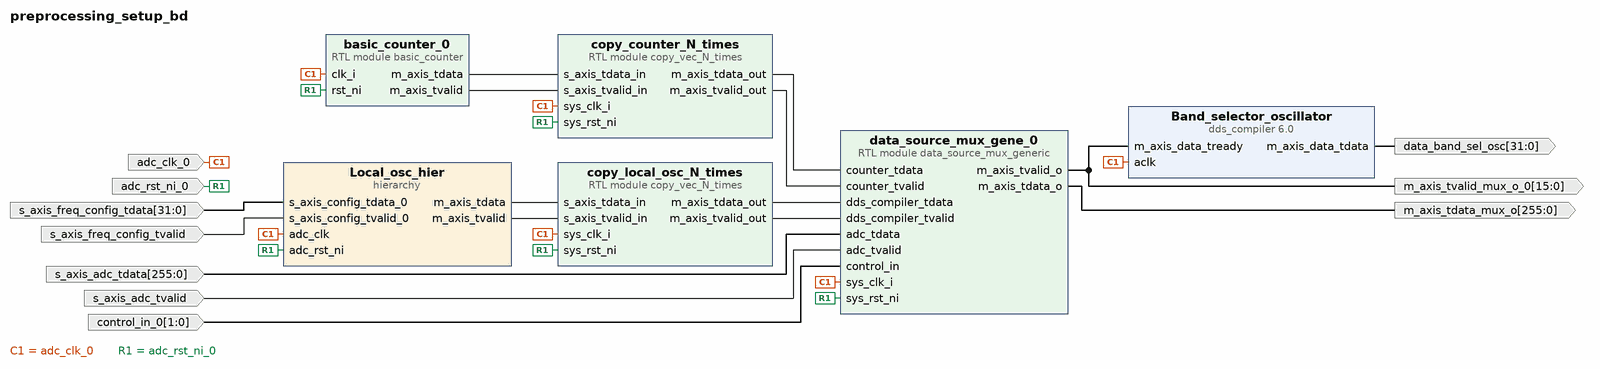
[diagram p0: block diagram of the top level]
# Vivado block design preprocessing_setup_bd, xc7z030fbg676-2, Vivado 2024.2
create_bd_design preprocessing_setup_bd

create_bd_port -dir I -type clk adc_clk_0
create_bd_port -dir I adc_rst_ni_0
create_bd_port -dir I -from 1 -to 0 control_in_0
create_bd_port -dir O -from 31 -to 0 data_band_sel_osc
create_bd_port -dir O -from 255 -to 0 m_axis_tdata_mux_o
create_bd_port -dir O -from 15 -to 0 m_axis_tvalid_mux_o_0
create_bd_port -dir I -from 255 -to 0 s_axis_adc_tdata
create_bd_port -dir I s_axis_adc_tvalid
create_bd_port -dir I -from 31 -to 0 s_axis_freq_config_tdata
create_bd_port -dir I s_axis_freq_config_tvalid

create_bd_cell -type ip -vlnv xilinx.com:ip:dds_compiler:6.0 Band_selector_oscillator
set_property -dict [list \
  CONFIG.Amplitude_Mode Full_Range \
  CONFIG.DATA_Has_TLAST Not_Required \
  CONFIG.DDS_Clock_Rate 260 \
  CONFIG.Frequency_Resolution 0.4 \
  CONFIG.Has_ARESETn false \
  CONFIG.Has_Phase_Out false \
  CONFIG.Has_TREADY true \
  CONFIG.Latency 9 \
  CONFIG.M_DATA_Has_TUSER Not_Required \
  CONFIG.Noise_Shaping None \
  CONFIG.Output_Frequency1 0 \
  CONFIG.Output_Width 16 \
  CONFIG.PINC1 1001000110111001000110111001001 \
  CONFIG.Parameter_Entry Hardware_Parameters \
  CONFIG.Phase_Increment Fixed \
  CONFIG.Phase_Width 32 \
  CONFIG.S_PHASE_Has_TUSER Not_Required \
] [get_bd_cells Band_selector_oscillator]
create_bd_cell -type hier Local_osc_hier
create_bd_cell -type module -reference basic_counter basic_counter_0
set_property -dict {CONFIG.DIVIDE_CLK_FREQ_BY 4} [get_bd_cells basic_counter_0]
create_bd_cell -type module -reference copy_vec_N_times copy_counter_N_times
set_property -dict {CONFIG.DATA_WIDTH 16 CONFIG.N 16} [get_bd_cells copy_counter_N_times]
create_bd_cell -type module -reference copy_vec_N_times copy_local_osc_N_times
set_property -dict {CONFIG.DATA_WIDTH 16 CONFIG.N 16} [get_bd_cells copy_local_osc_N_times]
create_bd_cell -type module -reference data_source_mux_generic data_source_mux_gene_0
set_property -dict {CONFIG.VEC_LEN 16} [get_bd_cells data_source_mux_gene_0]

# ---- hierarchy /Local_osc_hier ----
current_bd_instance /Local_osc_hier
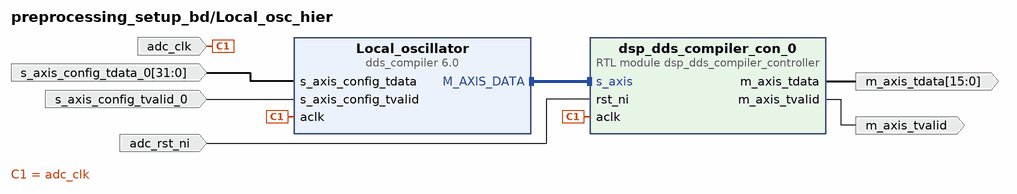
[diagram p1: block diagram inside /Local_osc_hier]
create_bd_pin -dir I -type clk adc_clk
create_bd_pin -dir I adc_rst_ni
create_bd_pin -dir O -from 15 -to 0 m_axis_tdata
create_bd_pin -dir O m_axis_tvalid
create_bd_pin -dir I -from 31 -to 0 s_axis_config_tdata_0
create_bd_pin -dir I s_axis_config_tvalid_0

create_bd_cell -type ip -vlnv xilinx.com:ip:dds_compiler:6.0 Local_oscillator
set_property -dict [list \
  CONFIG.DATA_Has_TLAST Not_Required \
  CONFIG.DDS_Clock_Rate 260 \
  CONFIG.Frequency_Resolution 0.4 \
  CONFIG.Has_ARESETn false \
  CONFIG.Has_Phase_Out false \
  CONFIG.Has_TREADY true \
  CONFIG.Latency 13 \
  CONFIG.M_DATA_Has_TUSER Not_Required \
  CONFIG.Noise_Shaping None \
  CONFIG.Output_Frequency1 0 \
  CONFIG.Output_Selection Cosine \
  CONFIG.Output_Width 16 \
  CONFIG.PINC1 1001100110101101110000111101001 \
  CONFIG.Parameter_Entry Hardware_Parameters \
  CONFIG.Phase_Increment Programmable \
  CONFIG.Phase_Width 32 \
  CONFIG.S_PHASE_Has_TUSER Not_Required \
] [get_bd_cells Local_oscillator]
create_bd_cell -type module -reference dsp_dds_compiler_controller dsp_dds_compiler_con_0
set_property -dict {CONFIG.DATA_WIDTH 16} [get_bd_cells dsp_dds_compiler_con_0]

# ---- connections ----

current_bd_instance /Local_osc_hier
connect_bd_intf_net [get_bd_intf_pins Local_oscillator/M_AXIS_DATA] [get_bd_intf_pins dsp_dds_compiler_con_0/s_axis]
connect_bd_net -net aclk_0_1 [get_bd_pins adc_clk] [get_bd_pins Local_oscillator/aclk] [get_bd_pins dsp_dds_compiler_con_0/aclk]
connect_bd_net [get_bd_pins dsp_dds_compiler_con_0/m_axis_tdata] [get_bd_pins m_axis_tdata]
connect_bd_net [get_bd_pins dsp_dds_compiler_con_0/m_axis_tvalid] [get_bd_pins m_axis_tvalid]
connect_bd_net -net rst_ni_0_1 [get_bd_pins adc_rst_ni] [get_bd_pins dsp_dds_compiler_con_0/rst_ni]
connect_bd_net -net s_axis_config_tdata_0_1 [get_bd_pins s_axis_config_tdata_0] [get_bd_pins Local_oscillator/s_axis_config_tdata]
connect_bd_net -net s_axis_config_tvalid_0_1 [get_bd_pins s_axis_config_tvalid_0] [get_bd_pins Local_oscillator/s_axis_config_tvalid]

current_bd_instance /
connect_bd_net [get_bd_pins Band_selector_oscillator/m_axis_data_tdata] [get_bd_ports data_band_sel_osc]
connect_bd_net [get_bd_pins Local_osc_hier/m_axis_tdata] [get_bd_pins copy_local_osc_N_times/s_axis_tdata_in]
connect_bd_net [get_bd_pins Local_osc_hier/m_axis_tvalid] [get_bd_pins copy_local_osc_N_times/s_axis_tvalid_in]
connect_bd_net -net adc_clk_0_2 [get_bd_ports adc_clk_0] \
  [get_bd_pins Band_selector_oscillator/aclk] [get_bd_pins Local_osc_hier/adc_clk] [get_bd_pins basic_counter_0/clk_i] \
  [get_bd_pins copy_counter_N_times/sys_clk_i] [get_bd_pins copy_local_osc_N_times/sys_clk_i] \
  [get_bd_pins data_source_mux_gene_0/sys_clk_i]
connect_bd_net -net adc_rst_ni_0_1 [get_bd_ports adc_rst_ni_0] \
  [get_bd_pins Local_osc_hier/adc_rst_ni] [get_bd_pins basic_counter_0/rst_ni] [get_bd_pins copy_counter_N_times/sys_rst_ni] \
  [get_bd_pins copy_local_osc_N_times/sys_rst_ni] [get_bd_pins data_source_mux_gene_0/sys_rst_ni]
connect_bd_net -net adc_tdata_0_1 [get_bd_ports s_axis_adc_tdata] [get_bd_pins data_source_mux_gene_0/adc_tdata]
connect_bd_net -net adc_tvalid_0_1 [get_bd_ports s_axis_adc_tvalid] [get_bd_pins data_source_mux_gene_0/adc_tvalid]
connect_bd_net [get_bd_pins basic_counter_0/m_axis_tdata] [get_bd_pins copy_counter_N_times/s_axis_tdata_in]
connect_bd_net [get_bd_pins basic_counter_0/m_axis_tvalid] [get_bd_pins copy_counter_N_times/s_axis_tvalid_in]
connect_bd_net -net control_in_0_1 [get_bd_ports control_in_0] [get_bd_pins data_source_mux_gene_0/control_in]
connect_bd_net [get_bd_pins copy_counter_N_times/m_axis_tdata_out] [get_bd_pins data_source_mux_gene_0/counter_tdata]
connect_bd_net [get_bd_pins copy_counter_N_times/m_axis_tvalid_out] [get_bd_pins data_source_mux_gene_0/counter_tvalid]
connect_bd_net [get_bd_pins copy_local_osc_N_times/m_axis_tdata_out] [get_bd_pins data_source_mux_gene_0/dds_compiler_tdata]
connect_bd_net [get_bd_pins copy_local_osc_N_times/m_axis_tvalid_out] [get_bd_pins data_source_mux_gene_0/dds_compiler_tvalid]
connect_bd_net [get_bd_pins data_source_mux_gene_0/m_axis_tdata_o] [get_bd_ports m_axis_tdata_mux_o]
connect_bd_net [get_bd_pins data_source_mux_gene_0/m_axis_tvalid_o] \
  [get_bd_ports m_axis_tvalid_mux_o_0] [get_bd_pins Band_selector_oscillator/m_axis_data_tready]
connect_bd_net -net s_axis_config_tdata_0_1 [get_bd_ports s_axis_freq_config_tdata] [get_bd_pins Local_osc_hier/s_axis_config_tdata_0]
connect_bd_net -net s_axis_config_tvalid_0_1 [get_bd_ports s_axis_freq_config_tvalid] [get_bd_pins Local_osc_hier/s_axis_config_tvalid_0]

validate_bd_design
save_bd_design
